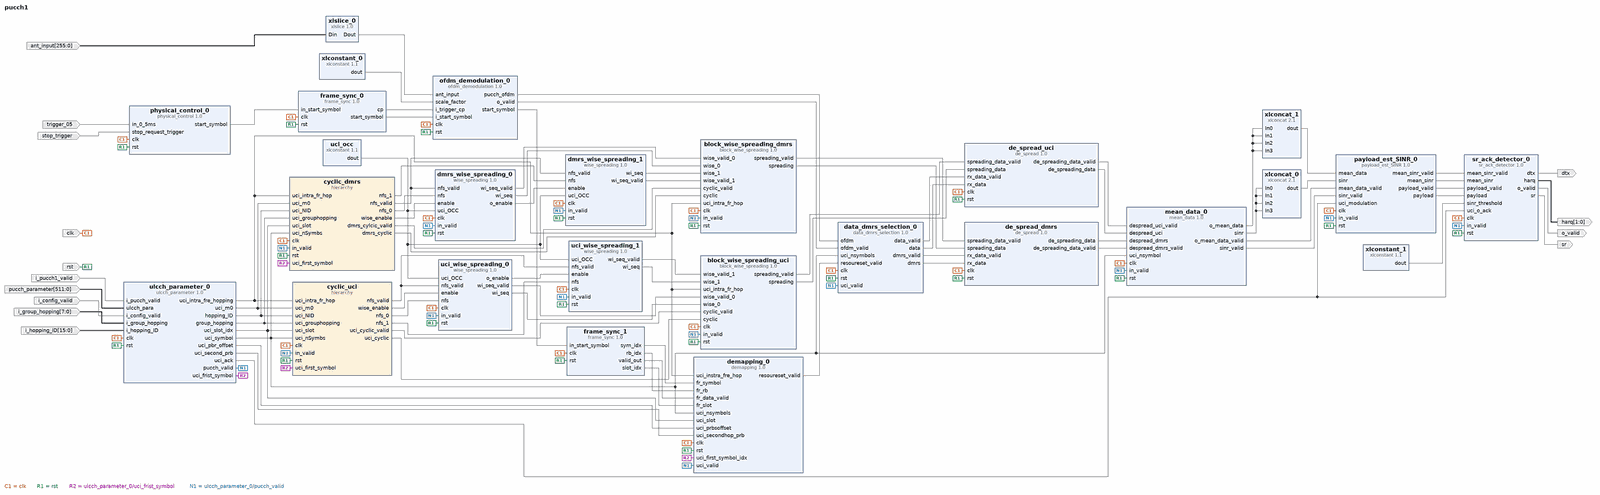
[diagram p0: block diagram of the top level, whole]
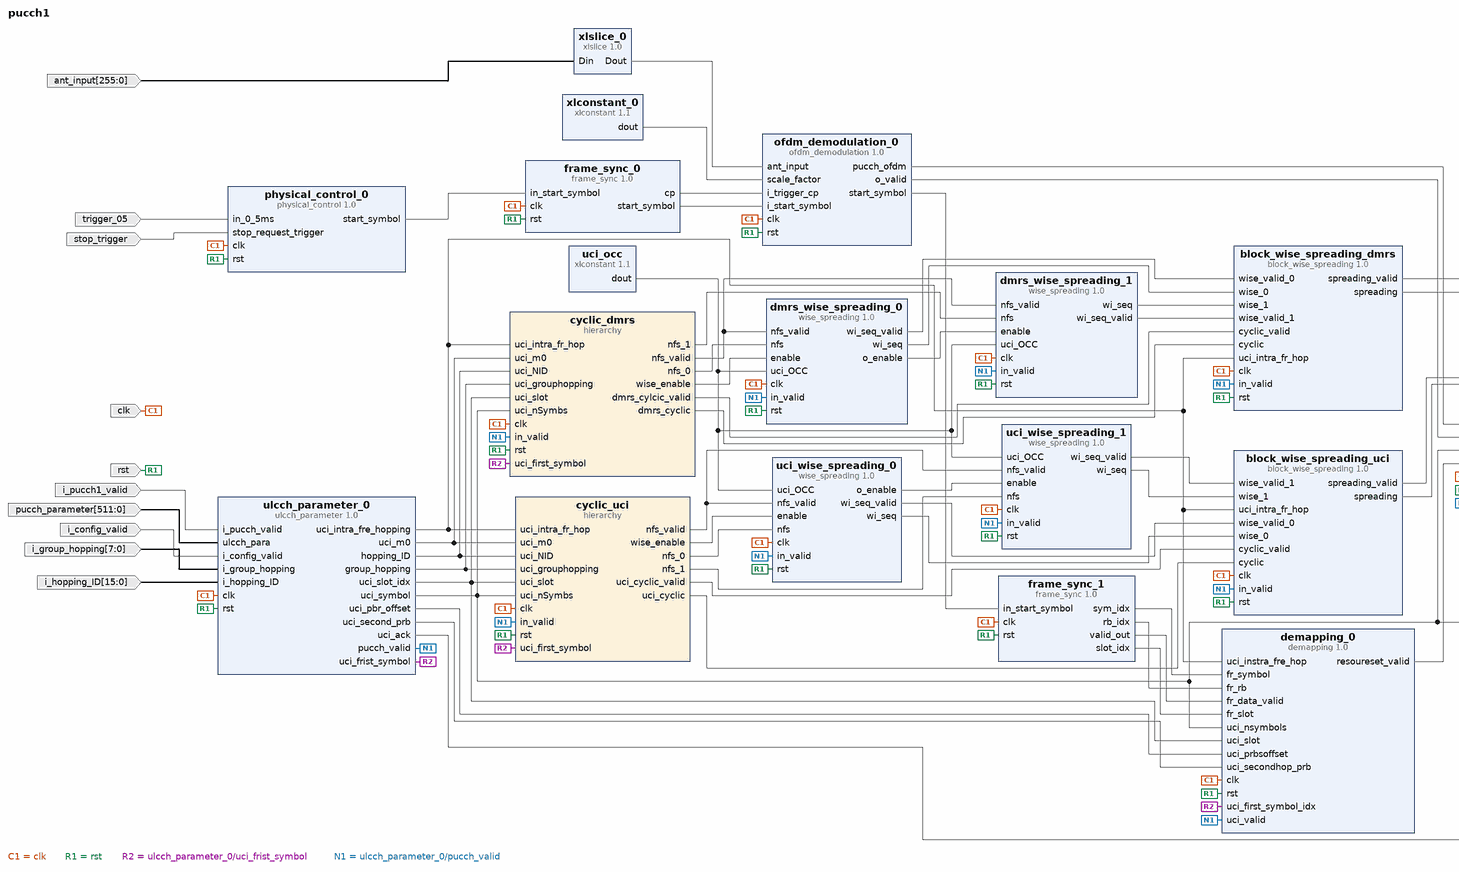
[diagram p1: block diagram of the top level, left part]
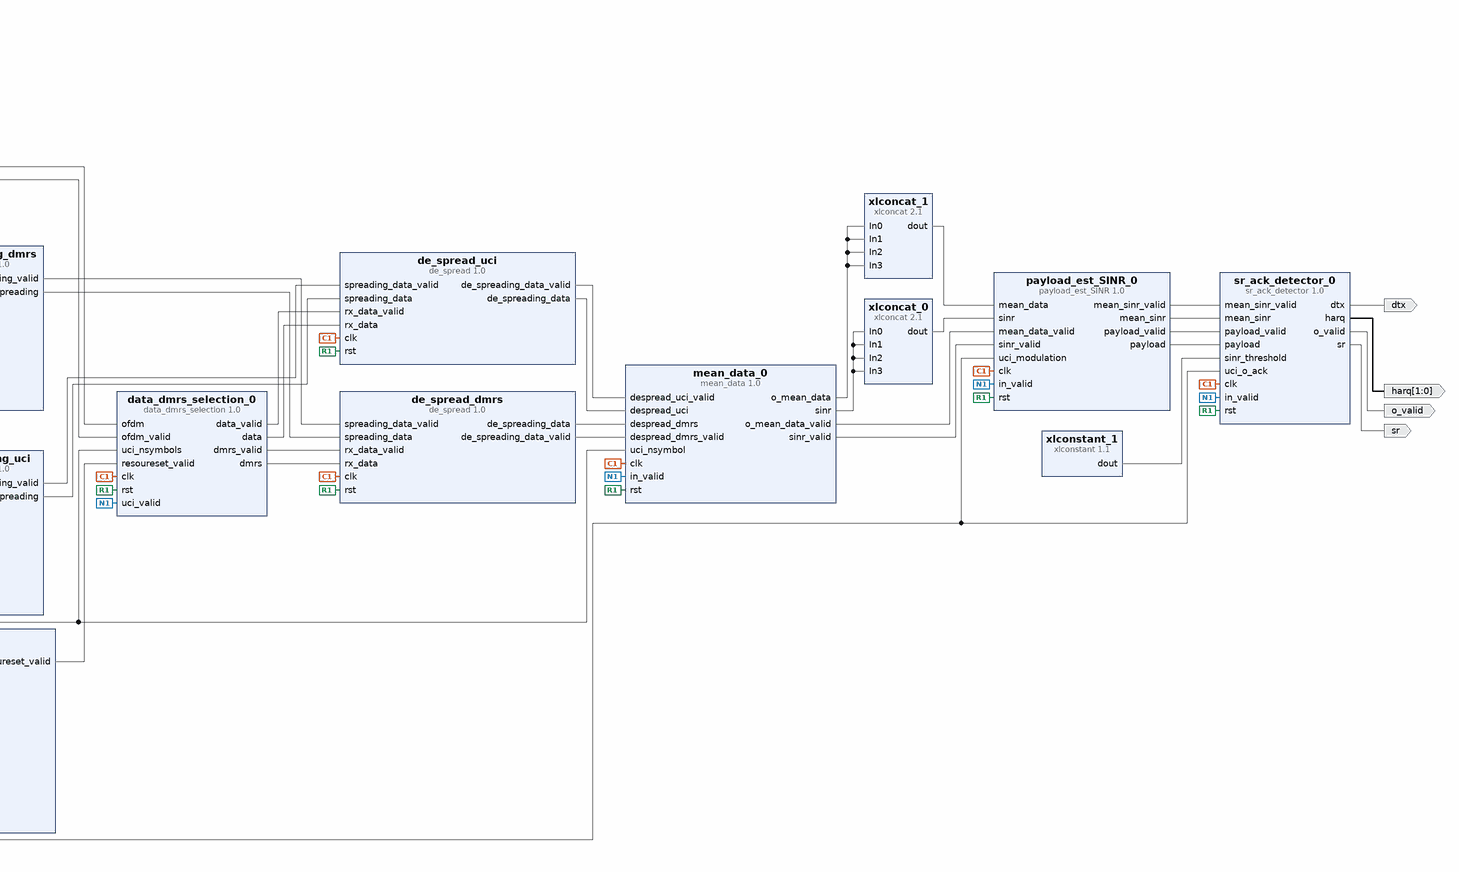
[diagram p2: block diagram of the top level, right part]
# Vivado block design pucch1, xcvu9p-flga2104-2L-e, Vivado 2019.2
create_bd_design pucch1

create_bd_port -dir I -type clk clk
set_property -dict {CONFIG.FREQ_HZ 122880000} [get_bd_ports clk]
create_bd_port -dir I -type rst rst
set_property -dict {CONFIG.POLARITY ACTIVE_HIGH} [get_bd_ports rst]
create_bd_port -dir I trigger_05
create_bd_port -dir I stop_trigger
create_bd_port -dir I -from 255 -to 0 ant_input
create_bd_port -dir I -from 511 -to 0 pucch_parameter
create_bd_port -dir I i_pucch1_valid
create_bd_port -dir I i_config_valid
create_bd_port -dir I -from 7 -to 0 i_group_hopping
create_bd_port -dir I -from 15 -to 0 i_hopping_ID
create_bd_port -dir O o_valid
create_bd_port -dir O dtx
create_bd_port -dir O sr
create_bd_port -dir O -from 1 -to 0 harq

create_bd_cell -type ip -vlnv xilinx.com:user:physical_control:1.0 physical_control_0
create_bd_cell -type ip -vlnv xilinx.com:user:frame_sync:1.0 frame_sync_0
create_bd_cell -type ip -vlnv xilinx.com:ip:xlconstant:1.1 xlconstant_0
set_property -dict {CONFIG.CONST_VAL 4 CONFIG.CONST_WIDTH 3} [get_bd_cells xlconstant_0]
create_bd_cell -type ip -vlnv xilinx.com:ip:xlslice:1.0 xlslice_0
set_property -dict {CONFIG.DIN_FROM 31 CONFIG.DIN_WIDTH 256 CONFIG.DOUT_WIDTH 32} [get_bd_cells xlslice_0]
create_bd_cell -type ip -vlnv xilinx.com:user:frame_sync:1.0 frame_sync_1
create_bd_cell -type ip -vlnv xilinx.com:user:ulcch_parameter:1.0 ulcch_parameter_0
create_bd_cell -type ip -vlnv xilinx.com:user:de_spread:1.0 de_spread_dmrs
create_bd_cell -type ip -vlnv xilinx.com:user:de_spread:1.0 de_spread_uci
create_bd_cell -type hier cyclic_dmrs
create_bd_cell -type hier cyclic_uci
create_bd_cell -type ip -vlnv xilinx.com:user:wise_spreading:1.0 uci_wise_spreading_0
create_bd_cell -type ip -vlnv xilinx.com:user:wise_spreading:1.0 uci_wise_spreading_1
create_bd_cell -type ip -vlnv xilinx.com:user:wise_spreading:1.0 dmrs_wise_spreading_1
create_bd_cell -type ip -vlnv xilinx.com:user:wise_spreading:1.0 dmrs_wise_spreading_0
create_bd_cell -type ip -vlnv xilinx.com:ip:xlconstant:1.1 xlconstant_1
set_property -dict {CONFIG.CONST_VAL 4 CONFIG.CONST_WIDTH 64} [get_bd_cells xlconstant_1]
create_bd_cell -type ip -vlnv xilinx.com:ip:xlconcat:2.1 xlconcat_0
set_property -dict [list \
  CONFIG.IN0_WIDTH 64 \
  CONFIG.IN1_WIDTH 64 \
  CONFIG.IN2_WIDTH 64 \
  CONFIG.IN3_WIDTH 64 \
  CONFIG.NUM_PORTS 4 \
] [get_bd_cells xlconcat_0]
create_bd_cell -type ip -vlnv xilinx.com:ip:xlconcat:2.1 xlconcat_1
set_property -dict [list \
  CONFIG.IN0_WIDTH 34 \
  CONFIG.IN1_WIDTH 34 \
  CONFIG.IN2_WIDTH 34 \
  CONFIG.IN3_WIDTH 34 \
  CONFIG.NUM_PORTS 4 \
] [get_bd_cells xlconcat_1]
create_bd_cell -type ip -vlnv xilinx.com:ip:xlconstant:1.1 uci_occ
set_property -dict {CONFIG.CONST_VAL 0 CONFIG.CONST_WIDTH 4} [get_bd_cells uci_occ]
create_bd_cell -type ip -vlnv xilinx.com:user:ofdm_demodulation:1.0 ofdm_demodulation_0
create_bd_cell -type ip -vlnv xilinx.com:user:mean_data:1.0 mean_data_0
create_bd_cell -type ip -vlnv xilinx.com:user:payload_est_SINR:1.0 payload_est_SINR_0
set_property -dict {CONFIG.RX 4} [get_bd_cells payload_est_SINR_0]
create_bd_cell -type ip -vlnv xilinx.com:user:sr_ack_detector:1.0 sr_ack_detector_0
create_bd_cell -type ip -vlnv xilinx.com:user:demapping:1.0 demapping_0
create_bd_cell -type ip -vlnv xilinx.com:user:data_dmrs_selection:1.0 data_dmrs_selection_0
create_bd_cell -type ip -vlnv xilinx.com:user:block_wise_spreading:1.0 block_wise_spreading_uci
create_bd_cell -type ip -vlnv xilinx.com:user:block_wise_spreading:1.0 block_wise_spreading_dmrs

# ---- hierarchy /cyclic_dmrs ----
current_bd_instance /cyclic_dmrs
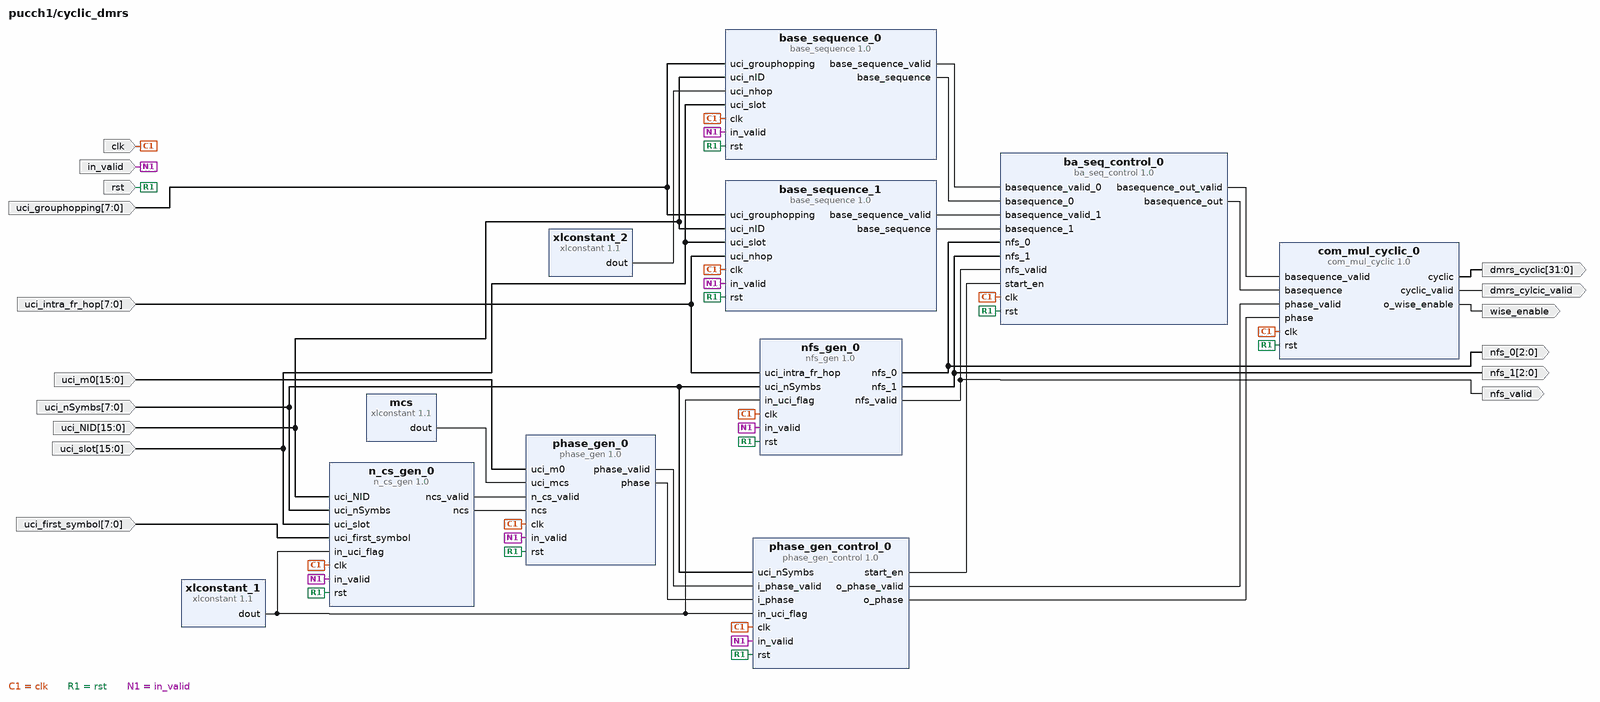
[diagram p3: block diagram inside /cyclic_dmrs]
create_bd_pin -dir I clk
create_bd_pin -dir I rst
create_bd_pin -dir I in_valid
create_bd_pin -dir I -from 15 -to 0 uci_m0
create_bd_pin -dir I -from 7 -to 0 uci_nSymbs
create_bd_pin -dir I -from 7 -to 0 uci_intra_fr_hop
create_bd_pin -dir I -from 15 -to 0 uci_NID
create_bd_pin -dir I -from 15 -to 0 uci_slot
create_bd_pin -dir I -from 7 -to 0 uci_first_symbol
create_bd_pin -dir I -from 7 -to 0 uci_grouphopping
create_bd_pin -dir O -from 31 -to 0 dmrs_cyclic
create_bd_pin -dir O dmrs_cylcic_valid
create_bd_pin -dir O wise_enable
create_bd_pin -dir O nfs_valid
create_bd_pin -dir O -from 2 -to 0 nfs_0
create_bd_pin -dir O -from 2 -to 0 nfs_1

create_bd_cell -type ip -vlnv xilinx.com:user:phase_gen:1.0 phase_gen_0
create_bd_cell -type ip -vlnv xilinx.com:user:com_mul_cyclic:1.0 com_mul_cyclic_0
create_bd_cell -type ip -vlnv xilinx.com:ip:xlconstant:1.1 mcs
set_property -dict {CONFIG.CONST_VAL 0 CONFIG.CONST_WIDTH 4} [get_bd_cells mcs]
create_bd_cell -type ip -vlnv xilinx.com:ip:xlconstant:1.1 xlconstant_1
set_property -dict {CONFIG.CONST_VAL 0 CONFIG.CONST_WIDTH 1} [get_bd_cells xlconstant_1]
create_bd_cell -type ip -vlnv xilinx.com:ip:xlconstant:1.1 xlconstant_2
set_property -dict {CONFIG.CONST_VAL 0 CONFIG.CONST_WIDTH 1} [get_bd_cells xlconstant_2]
create_bd_cell -type ip -vlnv xilinx.com:user:phase_gen_control:1.0 phase_gen_control_0
create_bd_cell -type ip -vlnv xilinx.com:user:base_sequence:1.0 base_sequence_0
create_bd_cell -type ip -vlnv xilinx.com:user:base_sequence:1.0 base_sequence_1
create_bd_cell -type ip -vlnv xilinx.com:user:n_cs_gen:1.0 n_cs_gen_0
create_bd_cell -type ip -vlnv xilinx.com:user:ba_seq_control:1.0 ba_seq_control_0
create_bd_cell -type ip -vlnv xilinx.com:user:nfs_gen:1.0 nfs_gen_0

# ---- hierarchy /cyclic_uci ----
current_bd_instance /cyclic_uci
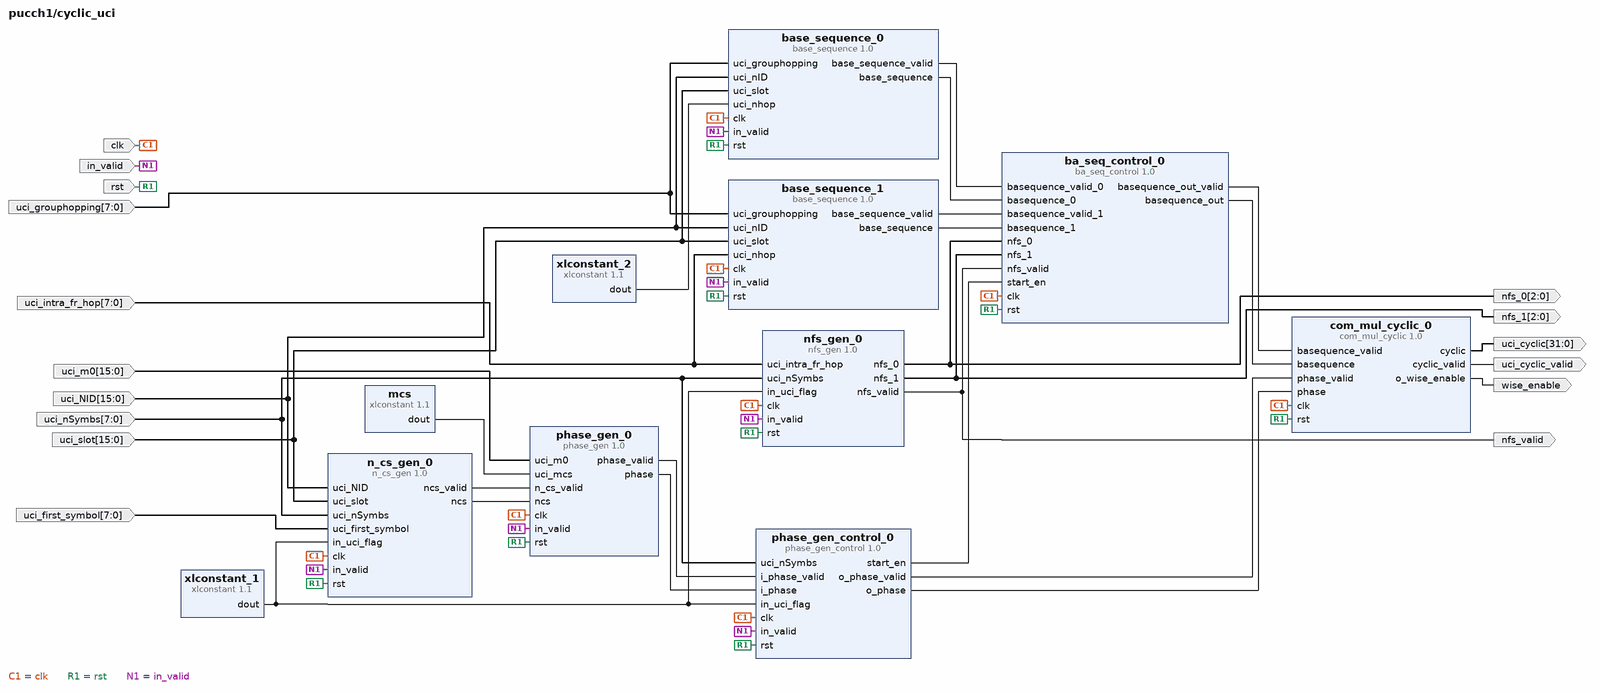
[diagram p4: block diagram inside /cyclic_uci]
create_bd_pin -dir I clk
create_bd_pin -dir I rst
create_bd_pin -dir I in_valid
create_bd_pin -dir I -from 15 -to 0 uci_m0
create_bd_pin -dir I -from 7 -to 0 uci_nSymbs
create_bd_pin -dir I -from 7 -to 0 uci_intra_fr_hop
create_bd_pin -dir I -from 15 -to 0 uci_NID
create_bd_pin -dir I -from 15 -to 0 uci_slot
create_bd_pin -dir I -from 7 -to 0 uci_first_symbol
create_bd_pin -dir I -from 7 -to 0 uci_grouphopping
create_bd_pin -dir O -from 31 -to 0 uci_cyclic
create_bd_pin -dir O uci_cyclic_valid
create_bd_pin -dir O wise_enable
create_bd_pin -dir O nfs_valid
create_bd_pin -dir O -from 2 -to 0 nfs_0
create_bd_pin -dir O -from 2 -to 0 nfs_1

create_bd_cell -type ip -vlnv xilinx.com:user:phase_gen:1.0 phase_gen_0
create_bd_cell -type ip -vlnv xilinx.com:user:com_mul_cyclic:1.0 com_mul_cyclic_0
create_bd_cell -type ip -vlnv xilinx.com:ip:xlconstant:1.1 mcs
set_property -dict {CONFIG.CONST_VAL 0 CONFIG.CONST_WIDTH 4} [get_bd_cells mcs]
create_bd_cell -type ip -vlnv xilinx.com:ip:xlconstant:1.1 xlconstant_1
set_property -dict {CONFIG.CONST_VAL 1 CONFIG.CONST_WIDTH 1} [get_bd_cells xlconstant_1]
create_bd_cell -type ip -vlnv xilinx.com:ip:xlconstant:1.1 xlconstant_2
set_property -dict {CONFIG.CONST_VAL 0 CONFIG.CONST_WIDTH 1} [get_bd_cells xlconstant_2]
create_bd_cell -type ip -vlnv xilinx.com:user:phase_gen_control:1.0 phase_gen_control_0
create_bd_cell -type ip -vlnv xilinx.com:user:base_sequence:1.0 base_sequence_0
create_bd_cell -type ip -vlnv xilinx.com:user:base_sequence:1.0 base_sequence_1
create_bd_cell -type ip -vlnv xilinx.com:user:n_cs_gen:1.0 n_cs_gen_0
create_bd_cell -type ip -vlnv xilinx.com:user:ba_seq_control:1.0 ba_seq_control_0
create_bd_cell -type ip -vlnv xilinx.com:user:nfs_gen:1.0 nfs_gen_0

# ---- connections ----

current_bd_instance /cyclic_dmrs
connect_bd_net [get_bd_pins clk] \
  [get_bd_pins phase_gen_0/clk] [get_bd_pins com_mul_cyclic_0/clk] [get_bd_pins phase_gen_control_0/clk] \
  [get_bd_pins base_sequence_0/clk] [get_bd_pins base_sequence_1/clk] [get_bd_pins n_cs_gen_0/clk] \
  [get_bd_pins ba_seq_control_0/clk] [get_bd_pins nfs_gen_0/clk]
connect_bd_net [get_bd_pins rst] \
  [get_bd_pins phase_gen_0/rst] [get_bd_pins com_mul_cyclic_0/rst] [get_bd_pins phase_gen_control_0/rst] \
  [get_bd_pins base_sequence_0/rst] [get_bd_pins base_sequence_1/rst] [get_bd_pins n_cs_gen_0/rst] \
  [get_bd_pins ba_seq_control_0/rst] [get_bd_pins nfs_gen_0/rst]
connect_bd_net [get_bd_pins in_valid] \
  [get_bd_pins phase_gen_0/in_valid] [get_bd_pins phase_gen_control_0/in_valid] [get_bd_pins base_sequence_0/in_valid] \
  [get_bd_pins base_sequence_1/in_valid] [get_bd_pins n_cs_gen_0/in_valid] [get_bd_pins nfs_gen_0/in_valid]
connect_bd_net -net uci_m0_1 [get_bd_pins uci_m0] [get_bd_pins phase_gen_0/uci_m0]
connect_bd_net [get_bd_pins uci_nSymbs] \
  [get_bd_pins phase_gen_control_0/uci_nSymbs] [get_bd_pins n_cs_gen_0/uci_nSymbs] [get_bd_pins nfs_gen_0/uci_nSymbs]
connect_bd_net [get_bd_pins uci_intra_fr_hop] [get_bd_pins base_sequence_1/uci_nhop] [get_bd_pins nfs_gen_0/uci_intra_fr_hop]
connect_bd_net [get_bd_pins uci_NID] [get_bd_pins base_sequence_0/uci_nID] [get_bd_pins base_sequence_1/uci_nID] [get_bd_pins n_cs_gen_0/uci_NID]
connect_bd_net [get_bd_pins uci_slot] [get_bd_pins base_sequence_0/uci_slot] [get_bd_pins base_sequence_1/uci_slot] [get_bd_pins n_cs_gen_0/uci_slot]
connect_bd_net [get_bd_pins uci_first_symbol] [get_bd_pins n_cs_gen_0/uci_first_symbol]
connect_bd_net [get_bd_pins n_cs_gen_0/ncs_valid] [get_bd_pins phase_gen_0/n_cs_valid]
connect_bd_net [get_bd_pins n_cs_gen_0/ncs] [get_bd_pins phase_gen_0/ncs]
connect_bd_net -net xlconstant_0_dout [get_bd_pins mcs/dout] [get_bd_pins phase_gen_0/uci_mcs]
connect_bd_net [get_bd_pins phase_gen_0/phase_valid] [get_bd_pins phase_gen_control_0/i_phase_valid]
connect_bd_net [get_bd_pins phase_gen_0/phase] [get_bd_pins phase_gen_control_0/i_phase]
connect_bd_net [get_bd_pins xlconstant_1/dout] \
  [get_bd_pins phase_gen_control_0/in_uci_flag] [get_bd_pins n_cs_gen_0/in_uci_flag] [get_bd_pins nfs_gen_0/in_uci_flag]
connect_bd_net [get_bd_pins uci_grouphopping] [get_bd_pins base_sequence_0/uci_grouphopping] [get_bd_pins base_sequence_1/uci_grouphopping]
connect_bd_net [get_bd_pins xlconstant_2/dout] [get_bd_pins base_sequence_0/uci_nhop]
connect_bd_net [get_bd_pins base_sequence_0/base_sequence_valid] [get_bd_pins ba_seq_control_0/basequence_valid_0]
connect_bd_net [get_bd_pins base_sequence_0/base_sequence] [get_bd_pins ba_seq_control_0/basequence_0]
connect_bd_net [get_bd_pins base_sequence_1/base_sequence_valid] [get_bd_pins ba_seq_control_0/basequence_valid_1]
connect_bd_net [get_bd_pins base_sequence_1/base_sequence] [get_bd_pins ba_seq_control_0/basequence_1]
connect_bd_net [get_bd_pins nfs_gen_0/nfs_0] [get_bd_pins nfs_0] [get_bd_pins ba_seq_control_0/nfs_0]
connect_bd_net [get_bd_pins nfs_gen_0/nfs_1] [get_bd_pins nfs_1] [get_bd_pins ba_seq_control_0/nfs_1]
connect_bd_net [get_bd_pins nfs_gen_0/nfs_valid] [get_bd_pins nfs_valid] [get_bd_pins ba_seq_control_0/nfs_valid]
connect_bd_net [get_bd_pins phase_gen_control_0/start_en] [get_bd_pins ba_seq_control_0/start_en]
connect_bd_net [get_bd_pins ba_seq_control_0/basequence_out_valid] [get_bd_pins com_mul_cyclic_0/basequence_valid]
connect_bd_net [get_bd_pins ba_seq_control_0/basequence_out] [get_bd_pins com_mul_cyclic_0/basequence]
connect_bd_net [get_bd_pins phase_gen_control_0/o_phase_valid] [get_bd_pins com_mul_cyclic_0/phase_valid]
connect_bd_net [get_bd_pins com_mul_cyclic_0/cyclic] [get_bd_pins dmrs_cyclic]
connect_bd_net [get_bd_pins com_mul_cyclic_0/cyclic_valid] [get_bd_pins dmrs_cylcic_valid]
connect_bd_net [get_bd_pins com_mul_cyclic_0/o_wise_enable] [get_bd_pins wise_enable]
connect_bd_net [get_bd_pins phase_gen_control_0/o_phase] [get_bd_pins com_mul_cyclic_0/phase]

current_bd_instance /cyclic_uci
connect_bd_net [get_bd_pins clk] \
  [get_bd_pins phase_gen_0/clk] [get_bd_pins com_mul_cyclic_0/clk] [get_bd_pins phase_gen_control_0/clk] \
  [get_bd_pins base_sequence_0/clk] [get_bd_pins base_sequence_1/clk] [get_bd_pins n_cs_gen_0/clk] \
  [get_bd_pins ba_seq_control_0/clk] [get_bd_pins nfs_gen_0/clk]
connect_bd_net [get_bd_pins rst] \
  [get_bd_pins phase_gen_0/rst] [get_bd_pins com_mul_cyclic_0/rst] [get_bd_pins phase_gen_control_0/rst] \
  [get_bd_pins base_sequence_0/rst] [get_bd_pins base_sequence_1/rst] [get_bd_pins n_cs_gen_0/rst] \
  [get_bd_pins ba_seq_control_0/rst] [get_bd_pins nfs_gen_0/rst]
connect_bd_net [get_bd_pins in_valid] \
  [get_bd_pins phase_gen_0/in_valid] [get_bd_pins phase_gen_control_0/in_valid] [get_bd_pins base_sequence_0/in_valid] \
  [get_bd_pins base_sequence_1/in_valid] [get_bd_pins n_cs_gen_0/in_valid] [get_bd_pins nfs_gen_0/in_valid]
connect_bd_net -net uci_m0_1 [get_bd_pins uci_m0] [get_bd_pins phase_gen_0/uci_m0]
connect_bd_net [get_bd_pins uci_nSymbs] \
  [get_bd_pins phase_gen_control_0/uci_nSymbs] [get_bd_pins n_cs_gen_0/uci_nSymbs] [get_bd_pins nfs_gen_0/uci_nSymbs]
connect_bd_net [get_bd_pins uci_intra_fr_hop] [get_bd_pins base_sequence_1/uci_nhop] [get_bd_pins nfs_gen_0/uci_intra_fr_hop]
connect_bd_net [get_bd_pins uci_NID] [get_bd_pins base_sequence_0/uci_nID] [get_bd_pins base_sequence_1/uci_nID] [get_bd_pins n_cs_gen_0/uci_NID]
connect_bd_net [get_bd_pins uci_slot] [get_bd_pins base_sequence_0/uci_slot] [get_bd_pins base_sequence_1/uci_slot] [get_bd_pins n_cs_gen_0/uci_slot]
connect_bd_net [get_bd_pins uci_first_symbol] [get_bd_pins n_cs_gen_0/uci_first_symbol]
connect_bd_net [get_bd_pins n_cs_gen_0/ncs_valid] [get_bd_pins phase_gen_0/n_cs_valid]
connect_bd_net [get_bd_pins n_cs_gen_0/ncs] [get_bd_pins phase_gen_0/ncs]
connect_bd_net -net xlconstant_0_dout [get_bd_pins mcs/dout] [get_bd_pins phase_gen_0/uci_mcs]
connect_bd_net [get_bd_pins phase_gen_0/phase_valid] [get_bd_pins phase_gen_control_0/i_phase_valid]
connect_bd_net [get_bd_pins phase_gen_0/phase] [get_bd_pins phase_gen_control_0/i_phase]
connect_bd_net [get_bd_pins xlconstant_1/dout] \
  [get_bd_pins phase_gen_control_0/in_uci_flag] [get_bd_pins n_cs_gen_0/in_uci_flag] [get_bd_pins nfs_gen_0/in_uci_flag]
connect_bd_net [get_bd_pins uci_grouphopping] [get_bd_pins base_sequence_0/uci_grouphopping] [get_bd_pins base_sequence_1/uci_grouphopping]
connect_bd_net [get_bd_pins xlconstant_2/dout] [get_bd_pins base_sequence_0/uci_nhop]
connect_bd_net [get_bd_pins base_sequence_0/base_sequence_valid] [get_bd_pins ba_seq_control_0/basequence_valid_0]
connect_bd_net [get_bd_pins base_sequence_0/base_sequence] [get_bd_pins ba_seq_control_0/basequence_0]
connect_bd_net [get_bd_pins base_sequence_1/base_sequence_valid] [get_bd_pins ba_seq_control_0/basequence_valid_1]
connect_bd_net [get_bd_pins base_sequence_1/base_sequence] [get_bd_pins ba_seq_control_0/basequence_1]
connect_bd_net [get_bd_pins nfs_gen_0/nfs_0] [get_bd_pins nfs_0] [get_bd_pins ba_seq_control_0/nfs_0]
connect_bd_net [get_bd_pins nfs_gen_0/nfs_1] [get_bd_pins nfs_1] [get_bd_pins ba_seq_control_0/nfs_1]
connect_bd_net [get_bd_pins nfs_gen_0/nfs_valid] [get_bd_pins nfs_valid] [get_bd_pins ba_seq_control_0/nfs_valid]
connect_bd_net [get_bd_pins phase_gen_control_0/start_en] [get_bd_pins ba_seq_control_0/start_en]
connect_bd_net [get_bd_pins ba_seq_control_0/basequence_out_valid] [get_bd_pins com_mul_cyclic_0/basequence_valid]
connect_bd_net [get_bd_pins ba_seq_control_0/basequence_out] [get_bd_pins com_mul_cyclic_0/basequence]
connect_bd_net [get_bd_pins phase_gen_control_0/o_phase_valid] [get_bd_pins com_mul_cyclic_0/phase_valid]
connect_bd_net [get_bd_pins com_mul_cyclic_0/cyclic] [get_bd_pins uci_cyclic]
connect_bd_net [get_bd_pins com_mul_cyclic_0/cyclic_valid] [get_bd_pins uci_cyclic_valid]
connect_bd_net [get_bd_pins com_mul_cyclic_0/o_wise_enable] [get_bd_pins wise_enable]
connect_bd_net [get_bd_pins phase_gen_control_0/o_phase] [get_bd_pins com_mul_cyclic_0/phase]

current_bd_instance /
connect_bd_net [get_bd_ports clk] \
  [get_bd_pins physical_control_0/clk] [get_bd_pins frame_sync_0/clk] [get_bd_pins frame_sync_1/clk] \
  [get_bd_pins ulcch_parameter_0/clk] [get_bd_pins de_spread_dmrs/clk] [get_bd_pins de_spread_uci/clk] \
  [get_bd_pins cyclic_dmrs/clk] [get_bd_pins cyclic_uci/clk] [get_bd_pins uci_wise_spreading_0/clk] \
  [get_bd_pins uci_wise_spreading_1/clk] [get_bd_pins dmrs_wise_spreading_0/clk] [get_bd_pins dmrs_wise_spreading_1/clk] \
  [get_bd_pins ofdm_demodulation_0/clk] [get_bd_pins mean_data_0/clk] [get_bd_pins payload_est_SINR_0/clk] \
  [get_bd_pins sr_ack_detector_0/clk] [get_bd_pins demapping_0/clk] [get_bd_pins data_dmrs_selection_0/clk] \
  [get_bd_pins block_wise_spreading_uci/clk] [get_bd_pins block_wise_spreading_dmrs/clk]
connect_bd_net [get_bd_ports rst] \
  [get_bd_pins physical_control_0/rst] [get_bd_pins frame_sync_0/rst] [get_bd_pins frame_sync_1/rst] \
  [get_bd_pins ulcch_parameter_0/rst] [get_bd_pins de_spread_dmrs/rst] [get_bd_pins de_spread_uci/rst] \
  [get_bd_pins cyclic_dmrs/rst] [get_bd_pins cyclic_uci/rst] [get_bd_pins uci_wise_spreading_0/rst] \
  [get_bd_pins uci_wise_spreading_1/rst] [get_bd_pins dmrs_wise_spreading_0/rst] [get_bd_pins dmrs_wise_spreading_1/rst] \
  [get_bd_pins ofdm_demodulation_0/rst] [get_bd_pins mean_data_0/rst] [get_bd_pins payload_est_SINR_0/rst] \
  [get_bd_pins sr_ack_detector_0/rst] [get_bd_pins demapping_0/rst] [get_bd_pins data_dmrs_selection_0/rst] \
  [get_bd_pins block_wise_spreading_uci/rst] [get_bd_pins block_wise_spreading_dmrs/rst]
connect_bd_net -net trigger_05_1 [get_bd_ports trigger_05] [get_bd_pins physical_control_0/in_0_5ms]
connect_bd_net [get_bd_ports stop_trigger] [get_bd_pins physical_control_0/stop_request_trigger]
connect_bd_net [get_bd_pins physical_control_0/start_symbol] [get_bd_pins frame_sync_0/in_start_symbol]
connect_bd_net [get_bd_pins xlconstant_0/dout] [get_bd_pins ofdm_demodulation_0/scale_factor]
connect_bd_net [get_bd_pins frame_sync_0/cp] [get_bd_pins ofdm_demodulation_0/i_trigger_cp]
connect_bd_net [get_bd_pins frame_sync_0/start_symbol] [get_bd_pins ofdm_demodulation_0/i_start_symbol]
connect_bd_net [get_bd_pins xlslice_0/Dout] [get_bd_pins ofdm_demodulation_0/ant_input]
connect_bd_net [get_bd_ports ant_input] [get_bd_pins xlslice_0/Din]
connect_bd_net [get_bd_pins ofdm_demodulation_0/start_symbol] [get_bd_pins frame_sync_1/in_start_symbol]
connect_bd_net [get_bd_ports i_pucch1_valid] [get_bd_pins ulcch_parameter_0/i_pucch_valid]
connect_bd_net [get_bd_ports pucch_parameter] [get_bd_pins ulcch_parameter_0/ulcch_para]
connect_bd_net [get_bd_ports i_config_valid] [get_bd_pins ulcch_parameter_0/i_config_valid]
connect_bd_net [get_bd_ports i_group_hopping] [get_bd_pins ulcch_parameter_0/i_group_hopping]
connect_bd_net [get_bd_ports i_hopping_ID] [get_bd_pins ulcch_parameter_0/i_hopping_ID]
connect_bd_net [get_bd_pins ulcch_parameter_0/uci_intra_fre_hopping] \
  [get_bd_pins cyclic_dmrs/uci_intra_fr_hop] [get_bd_pins cyclic_uci/uci_intra_fr_hop] \
  [get_bd_pins demapping_0/uci_instra_fre_hop] [get_bd_pins block_wise_spreading_dmrs/uci_intra_fr_hop] \
  [get_bd_pins block_wise_spreading_uci/uci_intra_fr_hop]
connect_bd_net [get_bd_pins ulcch_parameter_0/uci_slot_idx] \
  [get_bd_pins cyclic_dmrs/uci_slot] [get_bd_pins cyclic_uci/uci_slot] [get_bd_pins demapping_0/uci_slot]
connect_bd_net [get_bd_pins ulcch_parameter_0/uci_symbol] \
  [get_bd_pins cyclic_dmrs/uci_nSymbs] [get_bd_pins cyclic_uci/uci_nSymbs] [get_bd_pins mean_data_0/uci_nsymbol] \
  [get_bd_pins demapping_0/uci_nsymbols] [get_bd_pins data_dmrs_selection_0/uci_nsymbols]
connect_bd_net [get_bd_pins ulcch_parameter_0/uci_frist_symbol] \
  [get_bd_pins cyclic_dmrs/uci_first_symbol] [get_bd_pins cyclic_uci/uci_first_symbol] \
  [get_bd_pins demapping_0/uci_first_symbol_idx]
connect_bd_net [get_bd_pins ulcch_parameter_0/uci_pbr_offset] [get_bd_pins demapping_0/uci_prbsoffset]
connect_bd_net [get_bd_pins ulcch_parameter_0/uci_second_prb] [get_bd_pins demapping_0/uci_secondhop_prb]
connect_bd_net [get_bd_pins ulcch_parameter_0/pucch_valid] \
  [get_bd_pins cyclic_dmrs/in_valid] [get_bd_pins cyclic_uci/in_valid] [get_bd_pins uci_wise_spreading_0/in_valid] \
  [get_bd_pins uci_wise_spreading_1/in_valid] [get_bd_pins dmrs_wise_spreading_0/in_valid] \
  [get_bd_pins dmrs_wise_spreading_1/in_valid] [get_bd_pins mean_data_0/in_valid] [get_bd_pins payload_est_SINR_0/in_valid] \
  [get_bd_pins sr_ack_detector_0/in_valid] [get_bd_pins demapping_0/uci_valid] [get_bd_pins data_dmrs_selection_0/uci_valid] \
  [get_bd_pins block_wise_spreading_dmrs/in_valid] [get_bd_pins block_wise_spreading_uci/in_valid]
connect_bd_net [get_bd_pins frame_sync_1/sym_idx] [get_bd_pins demapping_0/fr_symbol]
connect_bd_net [get_bd_pins frame_sync_1/rb_idx] [get_bd_pins demapping_0/fr_rb]
connect_bd_net [get_bd_pins frame_sync_1/valid_out] [get_bd_pins demapping_0/fr_data_valid]
connect_bd_net [get_bd_pins demapping_0/resoureset_valid] [get_bd_pins data_dmrs_selection_0/resoureset_valid]
connect_bd_net [get_bd_pins ofdm_demodulation_0/pucch_ofdm] [get_bd_pins data_dmrs_selection_0/ofdm]
connect_bd_net [get_bd_pins ofdm_demodulation_0/o_valid] [get_bd_pins data_dmrs_selection_0/ofdm_valid]
connect_bd_net [get_bd_pins data_dmrs_selection_0/dmrs_valid] [get_bd_pins de_spread_dmrs/rx_data_valid]
connect_bd_net [get_bd_pins data_dmrs_selection_0/dmrs] [get_bd_pins de_spread_dmrs/rx_data]
connect_bd_net [get_bd_pins data_dmrs_selection_0/data_valid] [get_bd_pins de_spread_uci/rx_data_valid]
connect_bd_net [get_bd_pins data_dmrs_selection_0/data] [get_bd_pins de_spread_uci/rx_data]
connect_bd_net [get_bd_pins ulcch_parameter_0/uci_m0] [get_bd_pins cyclic_dmrs/uci_m0] [get_bd_pins cyclic_uci/uci_m0]
connect_bd_net [get_bd_pins ulcch_parameter_0/hopping_ID] [get_bd_pins cyclic_dmrs/uci_NID] [get_bd_pins cyclic_uci/uci_NID]
connect_bd_net [get_bd_pins ulcch_parameter_0/group_hopping] [get_bd_pins cyclic_dmrs/uci_grouphopping] [get_bd_pins cyclic_uci/uci_grouphopping]
connect_bd_net [get_bd_pins cyclic_uci/wise_enable] [get_bd_pins uci_wise_spreading_0/enable]
connect_bd_net -net dmrs_wise_spreading_0_o_enable [get_bd_pins uci_wise_spreading_0/o_enable] [get_bd_pins uci_wise_spreading_1/enable]
connect_bd_net [get_bd_pins cyclic_uci/nfs_valid] [get_bd_pins uci_wise_spreading_0/nfs_valid] [get_bd_pins uci_wise_spreading_1/nfs_valid]
connect_bd_net [get_bd_pins cyclic_uci/nfs_0] [get_bd_pins uci_wise_spreading_0/nfs]
connect_bd_net [get_bd_pins cyclic_uci/nfs_1] [get_bd_pins uci_wise_spreading_1/nfs]
connect_bd_net [get_bd_pins cyclic_uci/uci_cyclic_valid] [get_bd_pins block_wise_spreading_uci/cyclic_valid]
connect_bd_net [get_bd_pins cyclic_uci/uci_cyclic] [get_bd_pins block_wise_spreading_uci/cyclic]
connect_bd_net -net dmrs_wise_spreading_0_wi_seq_valid [get_bd_pins uci_wise_spreading_0/wi_seq_valid] \
  [get_bd_pins block_wise_spreading_uci/wise_valid_0]
connect_bd_net -net dmrs_wise_spreading_0_wi_seq [get_bd_pins uci_wise_spreading_0/wi_seq] [get_bd_pins block_wise_spreading_uci/wise_0]
connect_bd_net [get_bd_pins cyclic_dmrs/nfs_valid] [get_bd_pins dmrs_wise_spreading_0/nfs_valid] [get_bd_pins dmrs_wise_spreading_1/nfs_valid]
connect_bd_net [get_bd_pins cyclic_dmrs/nfs_0] [get_bd_pins dmrs_wise_spreading_0/nfs]
connect_bd_net [get_bd_pins cyclic_dmrs/wise_enable] [get_bd_pins dmrs_wise_spreading_0/enable]
connect_bd_net [get_bd_pins cyclic_dmrs/nfs_1] [get_bd_pins dmrs_wise_spreading_1/nfs]
connect_bd_net [get_bd_pins dmrs_wise_spreading_0/o_enable] [get_bd_pins dmrs_wise_spreading_1/enable]
connect_bd_net [get_bd_pins cyclic_dmrs/dmrs_cylcic_valid] [get_bd_pins block_wise_spreading_dmrs/cyclic_valid]
connect_bd_net [get_bd_pins cyclic_dmrs/dmrs_cyclic] [get_bd_pins block_wise_spreading_dmrs/cyclic]
connect_bd_net [get_bd_pins dmrs_wise_spreading_0/wi_seq_valid] [get_bd_pins block_wise_spreading_dmrs/wise_valid_0]
connect_bd_net [get_bd_pins dmrs_wise_spreading_0/wi_seq] [get_bd_pins block_wise_spreading_dmrs/wise_0]
connect_bd_net [get_bd_pins mean_data_0/o_mean_data_valid] [get_bd_pins payload_est_SINR_0/mean_data_valid]
connect_bd_net [get_bd_pins mean_data_0/sinr_valid] [get_bd_pins payload_est_SINR_0/sinr_valid]
connect_bd_net [get_bd_pins payload_est_SINR_0/mean_sinr_valid] [get_bd_pins sr_ack_detector_0/mean_sinr_valid]
connect_bd_net [get_bd_pins payload_est_SINR_0/mean_sinr] [get_bd_pins sr_ack_detector_0/mean_sinr]
connect_bd_net [get_bd_pins payload_est_SINR_0/payload_valid] [get_bd_pins sr_ack_detector_0/payload_valid]
connect_bd_net [get_bd_pins payload_est_SINR_0/payload] [get_bd_pins sr_ack_detector_0/payload]
connect_bd_net [get_bd_pins xlconstant_1/dout] [get_bd_pins sr_ack_detector_0/sinr_threshold]
connect_bd_net [get_bd_pins mean_data_0/sinr] \
  [get_bd_pins xlconcat_0/In0] [get_bd_pins xlconcat_0/In1] [get_bd_pins xlconcat_0/In2] [get_bd_pins xlconcat_0/In3]
connect_bd_net [get_bd_pins xlconcat_0/dout] [get_bd_pins payload_est_SINR_0/sinr]
connect_bd_net [get_bd_pins mean_data_0/o_mean_data] \
  [get_bd_pins xlconcat_1/In0] [get_bd_pins xlconcat_1/In1] [get_bd_pins xlconcat_1/In2] [get_bd_pins xlconcat_1/In3]
connect_bd_net [get_bd_pins xlconcat_1/dout] [get_bd_pins payload_est_SINR_0/mean_data]
connect_bd_net [get_bd_pins sr_ack_detector_0/o_valid] [get_bd_ports o_valid]
connect_bd_net [get_bd_pins sr_ack_detector_0/dtx] [get_bd_ports dtx]
connect_bd_net [get_bd_pins sr_ack_detector_0/sr] [get_bd_ports sr]
connect_bd_net [get_bd_pins sr_ack_detector_0/harq] [get_bd_ports harq]
connect_bd_net [get_bd_pins uci_occ/dout] \
  [get_bd_pins uci_wise_spreading_0/uci_OCC] [get_bd_pins uci_wise_spreading_1/uci_OCC] \
  [get_bd_pins dmrs_wise_spreading_0/uci_OCC] [get_bd_pins dmrs_wise_spreading_1/uci_OCC]
connect_bd_net [get_bd_pins ulcch_parameter_0/uci_ack] [get_bd_pins payload_est_SINR_0/uci_modulation] [get_bd_pins sr_ack_detector_0/uci_o_ack]
connect_bd_net [get_bd_pins frame_sync_1/slot_idx] [get_bd_pins demapping_0/fr_slot]
connect_bd_net -net block_wise_spreading_uci_spreading_valid [get_bd_pins block_wise_spreading_dmrs/spreading_valid] \
  [get_bd_pins de_spread_dmrs/spreading_data_valid]
connect_bd_net -net block_wise_spreading_uci_spreading [get_bd_pins block_wise_spreading_dmrs/spreading] [get_bd_pins de_spread_dmrs/spreading_data]
connect_bd_net [get_bd_pins dmrs_wise_spreading_1/wi_seq] [get_bd_pins block_wise_spreading_dmrs/wise_1]
connect_bd_net [get_bd_pins dmrs_wise_spreading_1/wi_seq_valid] [get_bd_pins block_wise_spreading_dmrs/wise_valid_1]
connect_bd_net -net dmrs_wise_spreading_1_wi_seq_valid [get_bd_pins uci_wise_spreading_1/wi_seq_valid] \
  [get_bd_pins block_wise_spreading_uci/wise_valid_1]
connect_bd_net -net dmrs_wise_spreading_1_wi_seq [get_bd_pins uci_wise_spreading_1/wi_seq] [get_bd_pins block_wise_spreading_uci/wise_1]
connect_bd_net [get_bd_pins block_wise_spreading_uci/spreading_valid] [get_bd_pins de_spread_uci/spreading_data_valid]
connect_bd_net [get_bd_pins block_wise_spreading_uci/spreading] [get_bd_pins de_spread_uci/spreading_data]
connect_bd_net [get_bd_pins de_spread_dmrs/de_spreading_data] [get_bd_pins mean_data_0/despread_dmrs]
connect_bd_net [get_bd_pins de_spread_uci/de_spreading_data_valid] [get_bd_pins mean_data_0/despread_uci_valid]
connect_bd_net [get_bd_pins de_spread_uci/de_spreading_data] [get_bd_pins mean_data_0/despread_uci]
connect_bd_net [get_bd_pins de_spread_dmrs/de_spreading_data_valid] [get_bd_pins mean_data_0/despread_dmrs_valid]

validate_bd_design
save_bd_design
